# Altium schematic sheet Current Monitor.SchDoc: Current Monitor.SchDoc
size A4; Organization: Altium Limited; Address1: L3, 12a Rodborough Rd; Address2: Frenchs Forest; Address3: NSW; Address4: Australia 2086
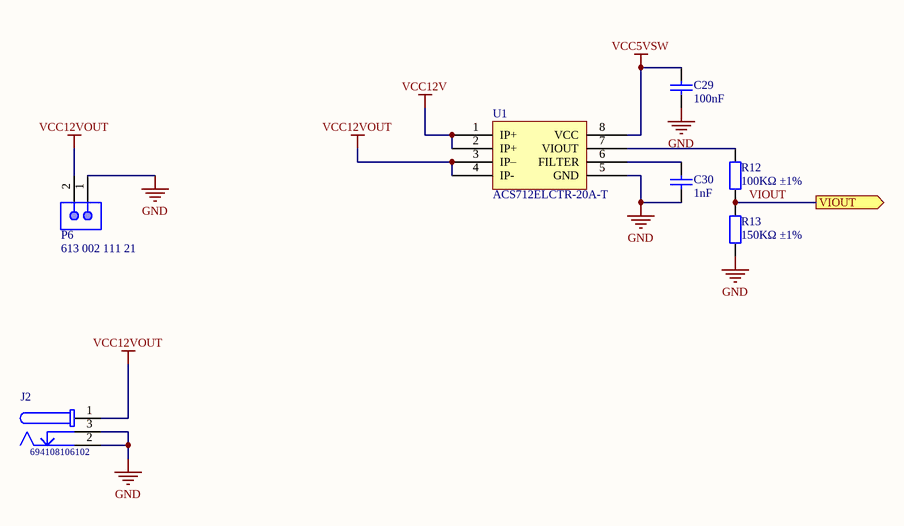
[diagram p0: Current Monitor.SchDoc]

## Parts
C29  100nF  [0402_C]
C30  1nF  [0402_C]
J2  694108106102  [694108106102]
P6  613 002 111 21  [WE-61300211121_V]
R12  100KΩ ±1%  [0402_R]
R13  150KΩ ±1%  [0402_R]
U1  ACS712ELCTR-20A-T  [SOIC-8_150mil]

## Ports
VIOUT (out)

## Nets
GND: C29.1 C30.1 J2.2 J2.3 P6.1 R13.1 U1.5(GND)
VCC5VSW: C29.2 U1.8(VCC)
VCC12V: U1.1(IP+) U1.2(IP+)
VCC12VOUT: J2.1 P6.2 U1.3(IP–) U1.4(IP-)
VIOUT: R12.1 R13.2 ; port VIOUT
NetC30_2: C30.2 U1.6(FILTER)
NetR12_2: R12.2 U1.7(VIOUT)

## Notes on the sheet
- Title
- Size:
- Date:
- A4
- Number:
- Time:
- Revision:
- Sheet
- of
- File:

## Library data of the parts
C29 = 0402 100nF (104) 10% 16V: Chip capacitors; Manufacturer: Samsung Electro-Mechanics; PartNumber: CL05B104KO5NNNC; Tolerance: 10%; Voltage: 16V; ComponentLink1Description: Supplier link; ComponentLink1URL: http://www.szlcsc.com/product/details_1877.html; Package: 0402; Supplier: LC; SuppliersPartNumber: C1525; Capacitance: 100nF
C30 = 0402 1nF (102) 10% 50V: Chip capacitor; Manufacturer: Guangdong Fenghua Advanced Tech; PartNumber: 0402B102K500NT; Tolerance: 10%; Voltage: 50V; ComponentLink1Description: Supplier link; ComponentLink1URL: http://www.szlcsc.com/product/details_1875.html; Package: 0402; Supplier: LC; SuppliersPartNumber: C1523; Capacitance: 1nF
J2 = CMP-1502-00180-1: DC Power Jack Connector with 4 soldering pads & Pegs WR-DC, Male, Right Angled, SMT, 5 A, 24 V; Manufacturer: Wurth Elektronik; Opening Diameter: 6.4mm; Plug Inner Diameter: 2.55mm; Working Voltage: 24V; Rated Current: 5A; Plug Outer Diameter: 5.5mm; Gender: Male; Mounting Technology: SMT; Packaging: TapeandReel; Orientation: RightAngled; Datasheet URL: http://katalog.we-online.de/em/datasheet/6941xx106102.pdf; Package Reference: 694108106102; Publisher: WurthElektronik; Manufacturer URL: http://www.we-online.de; Part Number: 694108106102; Operating Temperature: -40to85degC
P6 = CMP-1712-00002-3: Male Header, Pitch 2.54 mm, 1 x 2 Position, Height 8.54 mm, Tail Length 3 mm, -40 to 105 degC, RoHS, Bulk; Mounting Technology: Through Hole; Packaging: Bulk; Pins: 2; REACH SVHC: No SVHC; PartNumber: 613 002 111 21; PackageDescription: Male Header, Pitch 2.54 mm, 1 x 2 Position, Height 8.54 mm, Tail Length 3 mm; ComponentLink1Description: Manufacturer URL; Max Operating Temperature: 125 degC; ComponentLink1URL: https://www.we-online.com/; ComponentLink2Description: Datasheet; Mount: Through Hole; DatasheetVersion: Rev. J; Min Operating Temperature: -40 degC; ComponentLink2URL: http://katalog.we-online.de/em/datasheet/6130xx11121.pdf; RoHSCompliant: True
R12 = 0402 100K (1003) 1%: Chip resistor; Manufacturer: Uniroyal Elec; PartNumber: 0402WGF1003TCE; Power: 1/16W; ComponentLink1Description: Supplier link; ComponentLink1URL: http://www.szlcsc.com/product/details_26484.html; Package: 0402; Supplier: LC; SuppliersPartNumber: C25741; Resistance: 100KΩ; Tolerance: 1%
R13 = 0402 150K (1503) 1%: Chip resistor; Manufacturer: Uniroyal Elec; PartNumber: 0402WGF1503TCE; Power: 1/16W; ComponentLink1Description: Supplier link; ComponentLink1URL: http://www.szlcsc.com/product/details_26498.html; Package: 0402; Supplier: LC; SuppliersPartNumber: C25755; Resistance: 150KΩ; Tolerance: 1%
U1 = ACS712ELCTR-20A-T_[C10681]: 传感器; ComponentLink1Description: 供应商链接; ComponentLink1URL: http://www.szlcsc.com/product/details_11225.html; Package: SOIC-8_150mil; Supplier: LC; SuppliersPartNumber: C10681